# Altium project Fsociety_Keyboard.PrjPcb
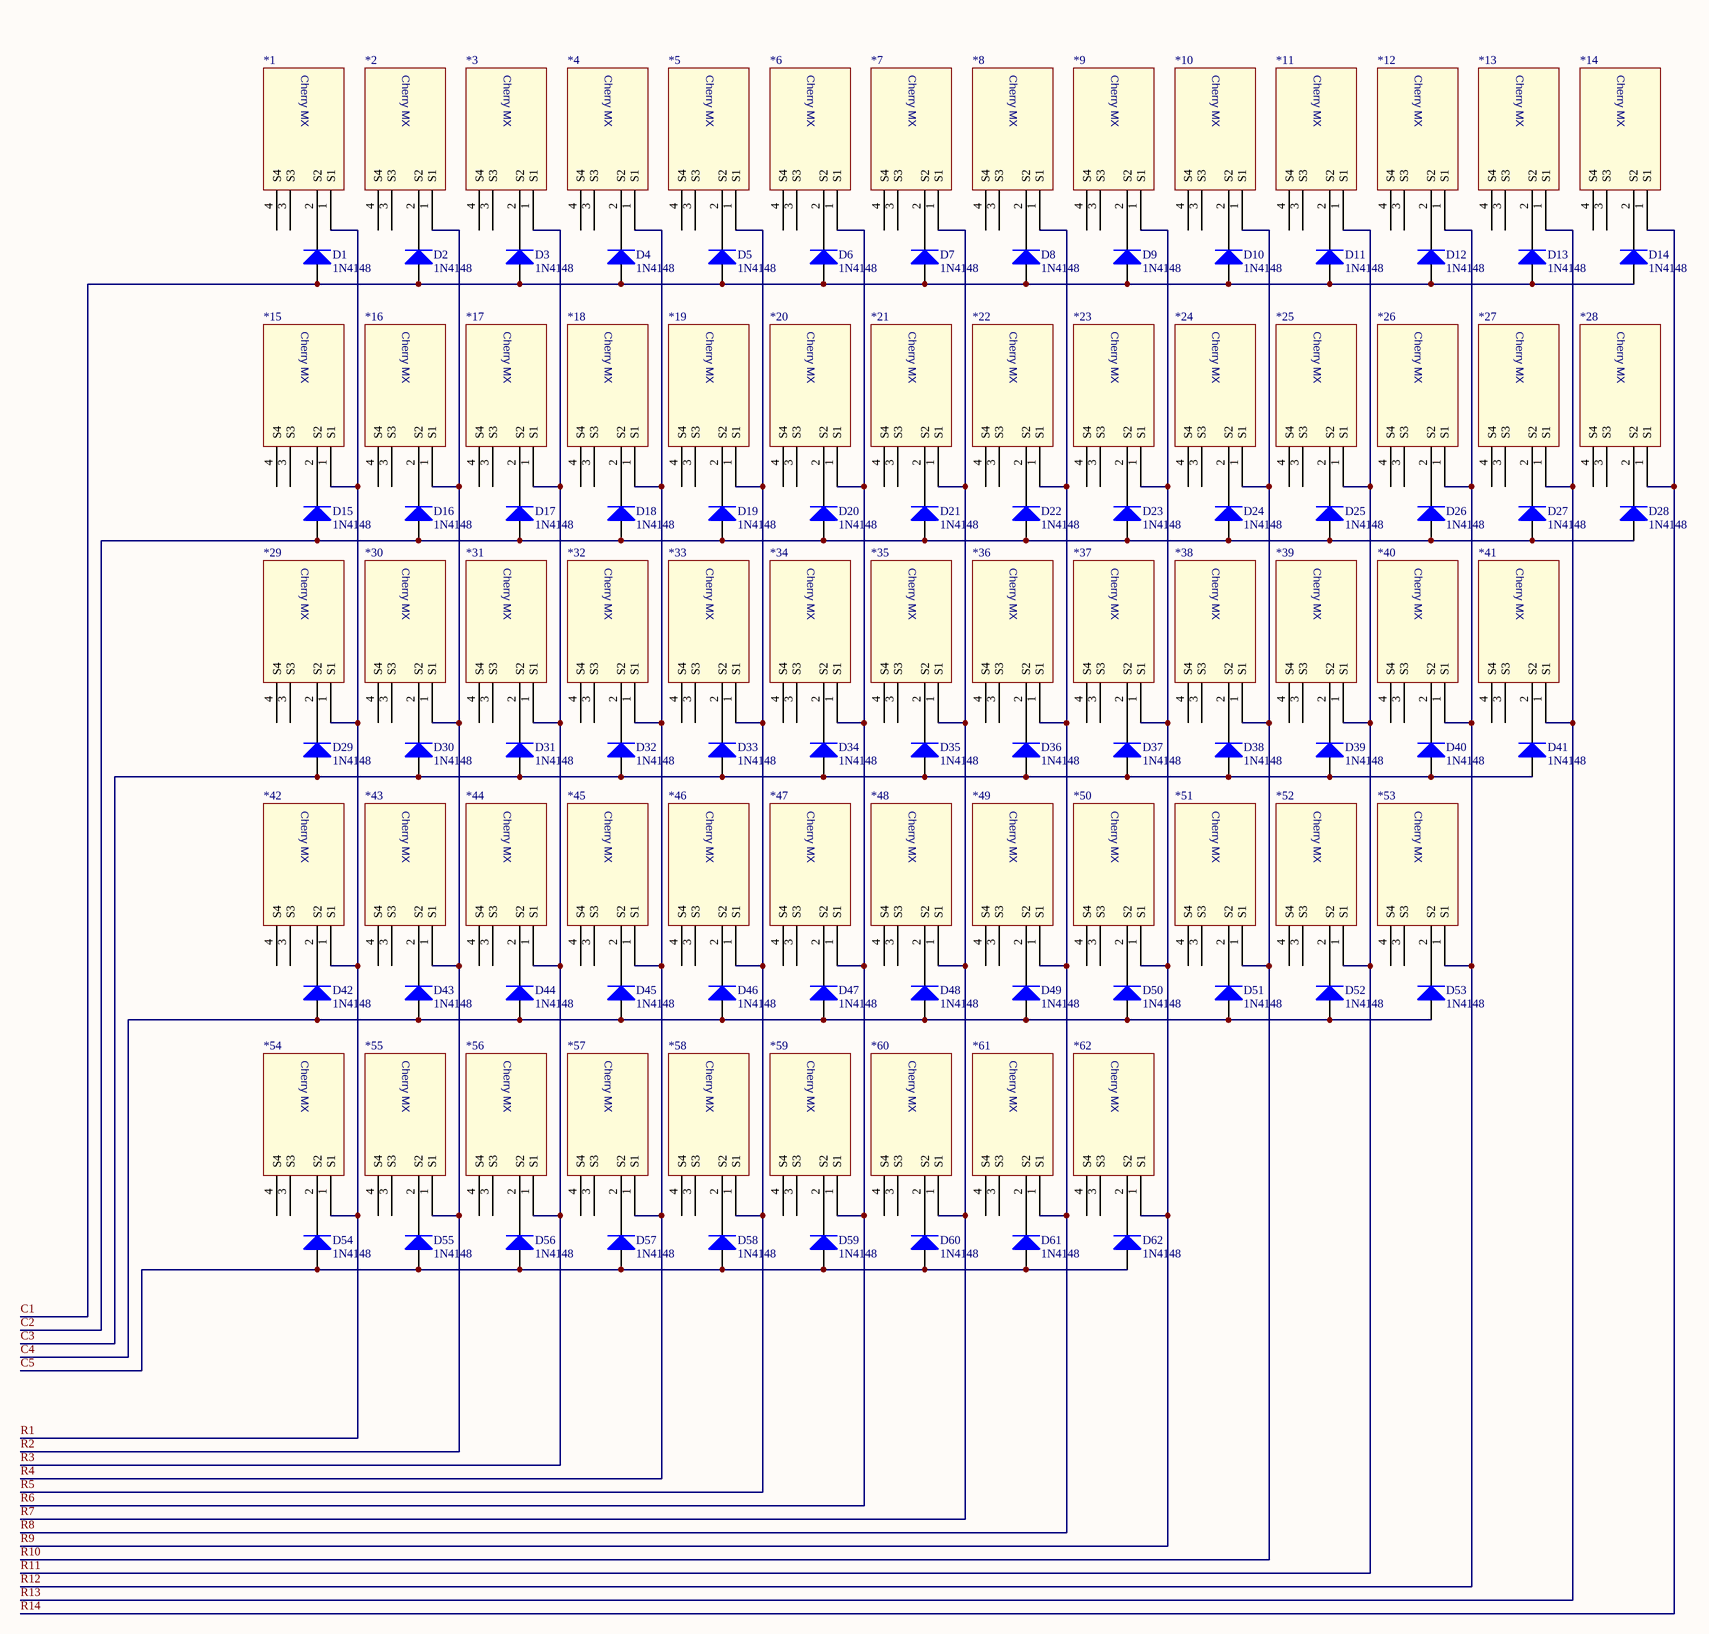
[diagram p0: Fsociety_Keyboard_SCH_Cherry.SchDoc]
3 sheets, 249 parts. Net scope: global (net labels, ports and power ports of the same name join across sheets).
Board file: Fsociety_Keyboard.PcbDoc
Sheets:
  Fsociety_Keyboard_SCH_Cherry.SchDoc
  Fsociety_Keyboard_SCH_LED.SchDoc
  Fsociety_Keyboard_SCH_Main.SchDoc

## Sheet Fsociety_Keyboard_SCH_Cherry.SchDoc: NEW DESIGN
size A2; CompanyName: Rena Electronica; Engineer: IK; Organization: Rena Electronica; Address1: de Ambachten 12; Address2: 4881 XZ; Address3: Zundert; Address4: the Netherlands; DocumentNumber: 05.xxx; Revision: 0.10; Customer: Klantnaam; PageSetup: Record=PageOptions|CenterHorizontal=True|CenterVertical=True|PrintScale=0.73|XCorrection=1.00|YCorrection=1.00|PrintKind=0|BorderSize=5000000|LeftOffset=0|BottomOffset=0|Orientation=2|PaperLength=1000|PaperWidth=1000|Scale=100|PaperSource=7|PrintQuality=-3|MediaType=1|DitherType=10|PrintScaleMode=1|PaperKind=A3|PaperIndex=8; ProjectName: R_NAAM.PRJ

### Parts
*1  CHERRY_MX  [CherryMX]  (value not drawn)
*2  CHERRY_MX  [CherryMX]  (value not drawn)
*3  CHERRY_MX  [CherryMX]  (value not drawn)
*4  CHERRY_MX  [CherryMX]  (value not drawn)
*5  CHERRY_MX  [CherryMX]  (value not drawn)
*6  CHERRY_MX  [CherryMX]  (value not drawn)
*7  CHERRY_MX  [CherryMX]  (value not drawn)
*8  CHERRY_MX  [CherryMX]  (value not drawn)
*9  CHERRY_MX  [CherryMX]  (value not drawn)
*10  CHERRY_MX  [CherryMX]  (value not drawn)
*11  CHERRY_MX  [CherryMX]  (value not drawn)
*12  CHERRY_MX  [CherryMX]  (value not drawn)
*13  CHERRY_MX  [CherryMX]  (value not drawn)
*14  CHERRY_MX  [CherryMX]  (value not drawn)
*15  CHERRY_MX  [CherryMX]  (value not drawn)
*16  CHERRY_MX  [CherryMX]  (value not drawn)
*17  CHERRY_MX  [CherryMX]  (value not drawn)
*18  CHERRY_MX  [CherryMX]  (value not drawn)
*19  CHERRY_MX  [CherryMX]  (value not drawn)
*20  CHERRY_MX  [CherryMX]  (value not drawn)
*21  CHERRY_MX  [CherryMX]  (value not drawn)
*22  CHERRY_MX  [CherryMX]  (value not drawn)
*23  CHERRY_MX  [CherryMX]  (value not drawn)
*24  CHERRY_MX  [CherryMX]  (value not drawn)
*25  CHERRY_MX  [CherryMX]  (value not drawn)
*26  CHERRY_MX  [CherryMX]  (value not drawn)
*27  CHERRY_MX  [CherryMX]  (value not drawn)
*28  CHERRY_MX  [CherryMX]  (value not drawn)
*29  CHERRY_MX  [CherryMX]  (value not drawn)
*30  CHERRY_MX  [CherryMX]  (value not drawn)
*31  CHERRY_MX  [CherryMX]  (value not drawn)
*32  CHERRY_MX  [CherryMX]  (value not drawn)
*33  CHERRY_MX  [CherryMX]  (value not drawn)
*34  CHERRY_MX  [CherryMX]  (value not drawn)
*35  CHERRY_MX  [CherryMX]  (value not drawn)
*36  CHERRY_MX  [CherryMX]  (value not drawn)
*37  CHERRY_MX  [CherryMX]  (value not drawn)
*38  CHERRY_MX  [CherryMX]  (value not drawn)
*39  CHERRY_MX  [CherryMX]  (value not drawn)
*40  CHERRY_MX  [CherryMX]  (value not drawn)
*41  CHERRY_MX  [CherryMX]  (value not drawn)
*42  CHERRY_MX  [CherryMX]  (value not drawn)
*43  CHERRY_MX  [CherryMX]  (value not drawn)
*44  CHERRY_MX  [CherryMX]  (value not drawn)
*45  CHERRY_MX  [CherryMX]  (value not drawn)
*46  CHERRY_MX  [CherryMX]  (value not drawn)
*47  CHERRY_MX  [CherryMX]  (value not drawn)
*48  CHERRY_MX  [CherryMX]  (value not drawn)
*49  CHERRY_MX  [CherryMX]  (value not drawn)
*50  CHERRY_MX  [CherryMX]  (value not drawn)
*51  CHERRY_MX  [CherryMX]  (value not drawn)
*52  CHERRY_MX  [CherryMX]  (value not drawn)
*53  CHERRY_MX  [CherryMX]  (value not drawn)
*54  CHERRY_MX  [CherryMX]  (value not drawn)
*55  CHERRY_MX  [CherryMX]  (value not drawn)
*56  CHERRY_MX  [CherryMX]  (value not drawn)
*57  CHERRY_MX  [CherryMX]  (value not drawn)
*58  CHERRY_MX  [CherryMX]  (value not drawn)
*59  CHERRY_MX  [CherryMX]  (value not drawn)
*60  CHERRY_MX  [CherryMX]  (value not drawn)
*61  CHERRY_MX  [CherryMX]  (value not drawn)
*62  CHERRY_MX  [CherryMX]  (value not drawn)
D1  1N4148  [DIOMELF3515_NR_SOD80C]
D2  1N4148  [DIOMELF3515_NR_SOD80C]
D3  1N4148  [DIOMELF3515_NR_SOD80C]
D4  1N4148  [DIOMELF3515_NR_SOD80C]
D5  1N4148  [DIOMELF3515_NR_SOD80C]
D6  1N4148  [DIOMELF3515_NR_SOD80C]
D7  1N4148  [DIOMELF3515_NR_SOD80C]
D8  1N4148  [DIOMELF3515_NR_SOD80C]
D9  1N4148  [DIOMELF3515_NR_SOD80C]
D10  1N4148  [DIOMELF3515_NR_SOD80C]
D11  1N4148  [DIOMELF3515_NR_SOD80C]
D12  1N4148  [DIOMELF3515_NR_SOD80C]
D13  1N4148  [DIOMELF3515_NR_SOD80C]
D14  1N4148  [DIOMELF3515_NR_SOD80C]
D15  1N4148  [DIOMELF3515_NR_SOD80C]
D16  1N4148  [DIOMELF3515_NR_SOD80C]
D17  1N4148  [DIOMELF3515_NR_SOD80C]
D18  1N4148  [DIOMELF3515_NR_SOD80C]
D19  1N4148  [DIOMELF3515_NR_SOD80C]
D20  1N4148  [DIOMELF3515_NR_SOD80C]
D21  1N4148  [DIOMELF3515_NR_SOD80C]
D22  1N4148  [DIOMELF3515_NR_SOD80C]
D23  1N4148  [DIOMELF3515_NR_SOD80C]
D24  1N4148  [DIOMELF3515_NR_SOD80C]
D25  1N4148  [DIOMELF3515_NR_SOD80C]
D26  1N4148  [DIOMELF3515_NR_SOD80C]
D27  1N4148  [DIOMELF3515_NR_SOD80C]
D28  1N4148  [DIOMELF3515_NR_SOD80C]
D29  1N4148  [DIOMELF3515_NR_SOD80C]
D30  1N4148  [DIOMELF3515_NR_SOD80C]
D31  1N4148  [DIOMELF3515_NR_SOD80C]
D32  1N4148  [DIOMELF3515_NR_SOD80C]
D33  1N4148  [DIOMELF3515_NR_SOD80C]
D34  1N4148  [DIOMELF3515_NR_SOD80C]
D35  1N4148  [DIOMELF3515_NR_SOD80C]
D36  1N4148  [DIOMELF3515_NR_SOD80C]
D37  1N4148  [DIOMELF3515_NR_SOD80C]
D38  1N4148  [DIOMELF3515_NR_SOD80C]
D39  1N4148  [DIOMELF3515_NR_SOD80C]
D40  1N4148  [DIOMELF3515_NR_SOD80C]
D41  1N4148  [DIOMELF3515_NR_SOD80C]
D42  1N4148  [DIOMELF3515_NR_SOD80C]
D43  1N4148  [DIOMELF3515_NR_SOD80C]
D44  1N4148  [DIOMELF3515_NR_SOD80C]
D45  1N4148  [DIOMELF3515_NR_SOD80C]
D46  1N4148  [DIOMELF3515_NR_SOD80C]
D47  1N4148  [DIOMELF3515_NR_SOD80C]
D48  1N4148  [DIOMELF3515_NR_SOD80C]
D49  1N4148  [DIOMELF3515_NR_SOD80C]
D50  1N4148  [DIOMELF3515_NR_SOD80C]
D51  1N4148  [DIOMELF3515_NR_SOD80C]
D52  1N4148  [DIOMELF3515_NR_SOD80C]
D53  1N4148  [DIOMELF3515_NR_SOD80C]
D54  1N4148  [DIOMELF3515_NR_SOD80C]
D55  1N4148  [DIOMELF3515_NR_SOD80C]
D56  1N4148  [DIOMELF3515_NR_SOD80C]
D57  1N4148  [DIOMELF3515_NR_SOD80C]
D58  1N4148  [DIOMELF3515_NR_SOD80C]
D59  1N4148  [DIOMELF3515_NR_SOD80C]
D60  1N4148  [DIOMELF3515_NR_SOD80C]
D61  1N4148  [DIOMELF3515_NR_SOD80C]
D62  1N4148  [DIOMELF3515_NR_SOD80C]

### Nets
C1: D1.A D2.A D3.A D4.A D5.A D6.A D7.A D8.A D9.A D10.A D11.A D12.A D13.A D14.A
C2: D15.A D16.A D17.A D18.A D19.A D20.A D21.A D22.A D23.A D24.A D25.A D26.A D27.A D28.A
C3: D29.A D30.A D31.A D32.A D33.A D34.A D35.A D36.A D37.A D38.A D39.A D40.A D41.A
C4: D42.A D43.A D44.A D45.A D46.A D47.A D48.A D49.A D50.A D51.A D52.A D53.A
C5: D54.A D55.A D56.A D57.A D58.A D59.A D60.A D61.A D62.A
R1: *1.1(S1) *15.1(S1) *29.1(S1) *42.1(S1) *54.1(S1)
R2: *2.1(S1) *16.1(S1) *30.1(S1) *43.1(S1) *55.1(S1)
R3: *3.1(S1) *17.1(S1) *31.1(S1) *44.1(S1) *56.1(S1)
R4: *4.1(S1) *18.1(S1) *32.1(S1) *45.1(S1) *57.1(S1)
R5: *5.1(S1) *19.1(S1) *33.1(S1) *46.1(S1) *58.1(S1)
R6: *6.1(S1) *20.1(S1) *34.1(S1) *47.1(S1) *59.1(S1)
R7: *7.1(S1) *21.1(S1) *35.1(S1) *48.1(S1) *60.1(S1)
R8: *8.1(S1) *22.1(S1) *36.1(S1) *49.1(S1) *61.1(S1)
R9: *9.1(S1) *23.1(S1) *37.1(S1) *50.1(S1) *62.1(S1)
R10: *10.1(S1) *24.1(S1) *38.1(S1) *51.1(S1)
R11: *11.1(S1) *25.1(S1) *39.1(S1) *52.1(S1)
R12: *12.1(S1) *26.1(S1) *40.1(S1) *53.1(S1)
R13: *13.1(S1) *27.1(S1) *41.1(S1)
R14: *14.1(S1) *28.1(S1)
Net*1_2: *1.2(S2) D1.C
Net*2_2: *2.2(S2) D2.C
Net*3_2: *3.2(S2) D3.C
Net*4_2: *4.2(S2) D4.C
Net*5_2: *5.2(S2) D5.C
Net*6_2: *6.2(S2) D6.C
Net*7_2: *7.2(S2) D7.C
Net*8_2: *8.2(S2) D8.C
Net*9_2: *9.2(S2) D9.C
Net*10_2: *10.2(S2) D10.C
Net*11_2: *11.2(S2) D11.C
Net*12_2: *12.2(S2) D12.C
Net*13_2: *13.2(S2) D13.C
Net*14_2: *14.2(S2) D14.C
Net*15_2: *15.2(S2) D15.C
Net*16_2: *16.2(S2) D16.C
Net*17_2: *17.2(S2) D17.C
Net*18_2: *18.2(S2) D18.C
Net*19_2: *19.2(S2) D19.C
Net*20_2: *20.2(S2) D20.C
Net*21_2: *21.2(S2) D21.C
Net*22_2: *22.2(S2) D22.C
Net*23_2: *23.2(S2) D23.C
Net*24_2: *24.2(S2) D24.C
Net*25_2: *25.2(S2) D25.C
Net*26_2: *26.2(S2) D26.C
Net*27_2: *27.2(S2) D27.C
Net*28_2: *28.2(S2) D28.C
Net*29_2: *29.2(S2) D29.C
Net*30_2: *30.2(S2) D30.C
Net*31_2: *31.2(S2) D31.C
Net*32_2: *32.2(S2) D32.C
Net*33_2: *33.2(S2) D33.C
Net*34_2: *34.2(S2) D34.C
Net*35_2: *35.2(S2) D35.C
Net*36_2: *36.2(S2) D36.C
Net*37_2: *37.2(S2) D37.C
Net*38_2: *38.2(S2) D38.C
Net*39_2: *39.2(S2) D39.C
Net*40_2: *40.2(S2) D40.C
Net*41_2: *41.2(S2) D41.C
Net*42_2: *42.2(S2) D42.C
Net*43_2: *43.2(S2) D43.C
Net*44_2: *44.2(S2) D44.C
Net*45_2: *45.2(S2) D45.C
Net*46_2: *46.2(S2) D46.C
Net*47_2: *47.2(S2) D47.C
Net*48_2: *48.2(S2) D48.C
Net*49_2: *49.2(S2) D49.C
Net*50_2: *50.2(S2) D50.C
Net*51_2: *51.2(S2) D51.C
Net*52_2: *52.2(S2) D52.C
Net*53_2: *53.2(S2) D53.C
Net*54_2: *54.2(S2) D54.C
Net*55_2: *55.2(S2) D55.C
Net*56_2: *56.2(S2) D56.C
Net*57_2: *57.2(S2) D57.C
Net*58_2: *58.2(S2) D58.C
Net*59_2: *59.2(S2) D59.C
Net*60_2: *60.2(S2) D60.C
Net*61_2: *61.2(S2) D61.C
Net*62_2: *62.2(S2) D62.C

Not connected (* = marked no-connect by the designer): *1 3(S3) 4(S4); *2 3(S3) 4(S4); *3 3(S3) 4(S4); *4 3(S3) 4(S4); *5 3(S3) 4(S4); *6 3(S3) 4(S4); *7 3(S3) 4(S4); *8 3(S3) 4(S4); *9 3(S3) 4(S4); *10 3(S3) 4(S4); *11 3(S3) 4(S4); *12 3(S3) 4(S4); *13 3(S3) 4(S4); *14 3(S3) 4(S4); *15 3(S3) 4(S4); *16 3(S3) 4(S4); *17 3(S3) 4(S4); *18 3(S3) 4(S4); *19 3(S3) 4(S4); *20 3(S3) 4(S4); *21 3(S3) 4(S4); *22 3(S3) 4(S4); *23 3(S3) 4(S4); *24 3(S3) 4(S4); *25 3(S3) 4(S4); *26 3(S3) 4(S4); *27 3(S3) 4(S4); *28 3(S3) 4(S4); *29 3(S3) 4(S4); *30 3(S3) 4(S4); *31 3(S3) 4(S4); *32 3(S3) 4(S4); *33 3(S3) 4(S4); *34 3(S3) 4(S4); *35 3(S3) 4(S4); *36 3(S3) 4(S4); *37 3(S3) 4(S4); *38 3(S3) 4(S4); *39 3(S3) 4(S4); *40 3(S3) 4(S4); *41 3(S3) 4(S4); *42 3(S3) 4(S4); *43 3(S3) 4(S4); *44 3(S3) 4(S4); *45 3(S3) 4(S4); *46 3(S3) 4(S4); *47 3(S3) 4(S4); *48 3(S3) 4(S4); *49 3(S3) 4(S4); *50 3(S3) 4(S4); *51 3(S3) 4(S4); *52 3(S3) 4(S4); *53 3(S3) 4(S4); *54 3(S3) 4(S4); *55 3(S3) 4(S4); *56 3(S3) 4(S4); *57 3(S3) 4(S4); *58 3(S3) 4(S4); *59 3(S3) 4(S4); *60 3(S3) 4(S4); *61 3(S3) 4(S4); *62 3(S3) 4(S4)

### Notes on the sheet
- (in symbol CHERRY_MX) Cherry MX

### Library data of the parts
D1-D62 = CMP-00137-A.4: Diode 1N4148 SOD80(SMT); MAXPartNumber: 1N4148!; PartNumber: LL4148-GS18-LF; Manufacturer: Vishay; IFSM Max (A): 0.5; Packing: Tape en Reel; Type: Fast; Reverse Voltage: 100V; Forward Voltage: ? V; IF (Cont): ? A; ComponentLink1Description: Manufacturer URL; ComponentLink1URL: http://www.vishay.com/; ComponentLink2Description: Datasheet; ComponentLink2URL: http://www.vishay.com/docs/85557/ll4148.pdf; ComponentLink3Description: Package Specification; ComponentLink3URL: http://www.vishay.com/docs/85557/ll4148.pdf; Mounting Technology: Surface Mount; PackageDescription: Melf Diode; PackageReference: SOD80; RoHS: TRUE; FLS_PN: 1N4148!; RENA_PN: 1N4148!; IF (Max): ? A

## Sheet Fsociety_Keyboard_SCH_LED.SchDoc: NEW DESIGN
size A1; CompanyName: Rena Electronica; Engineer: IK; Organization: Rena Electronica; Address1: de Ambachten 12; Address2: 4881 XZ; Address3: Zundert; Address4: the Netherlands; DocumentNumber: 05.xxx; Revision: 0.10; Customer: Klantnaam; PageSetup: Record=PageOptions|CenterHorizontal=True|CenterVertical=True|PrintScale=0.52|XCorrection=1.00|YCorrection=1.00|PrintKind=0|BorderSize=5000000|LeftOffset=0|BottomOffset=0|Orientation=2|PaperLength=1000|PaperWidth=1000|Scale=100|PaperSource=7|PrintQuality=-3|MediaType=1|DitherType=10|PrintScaleMode=1|PaperKind=A3|PaperIndex=8; ProjectName: R_NAAM.PRJ
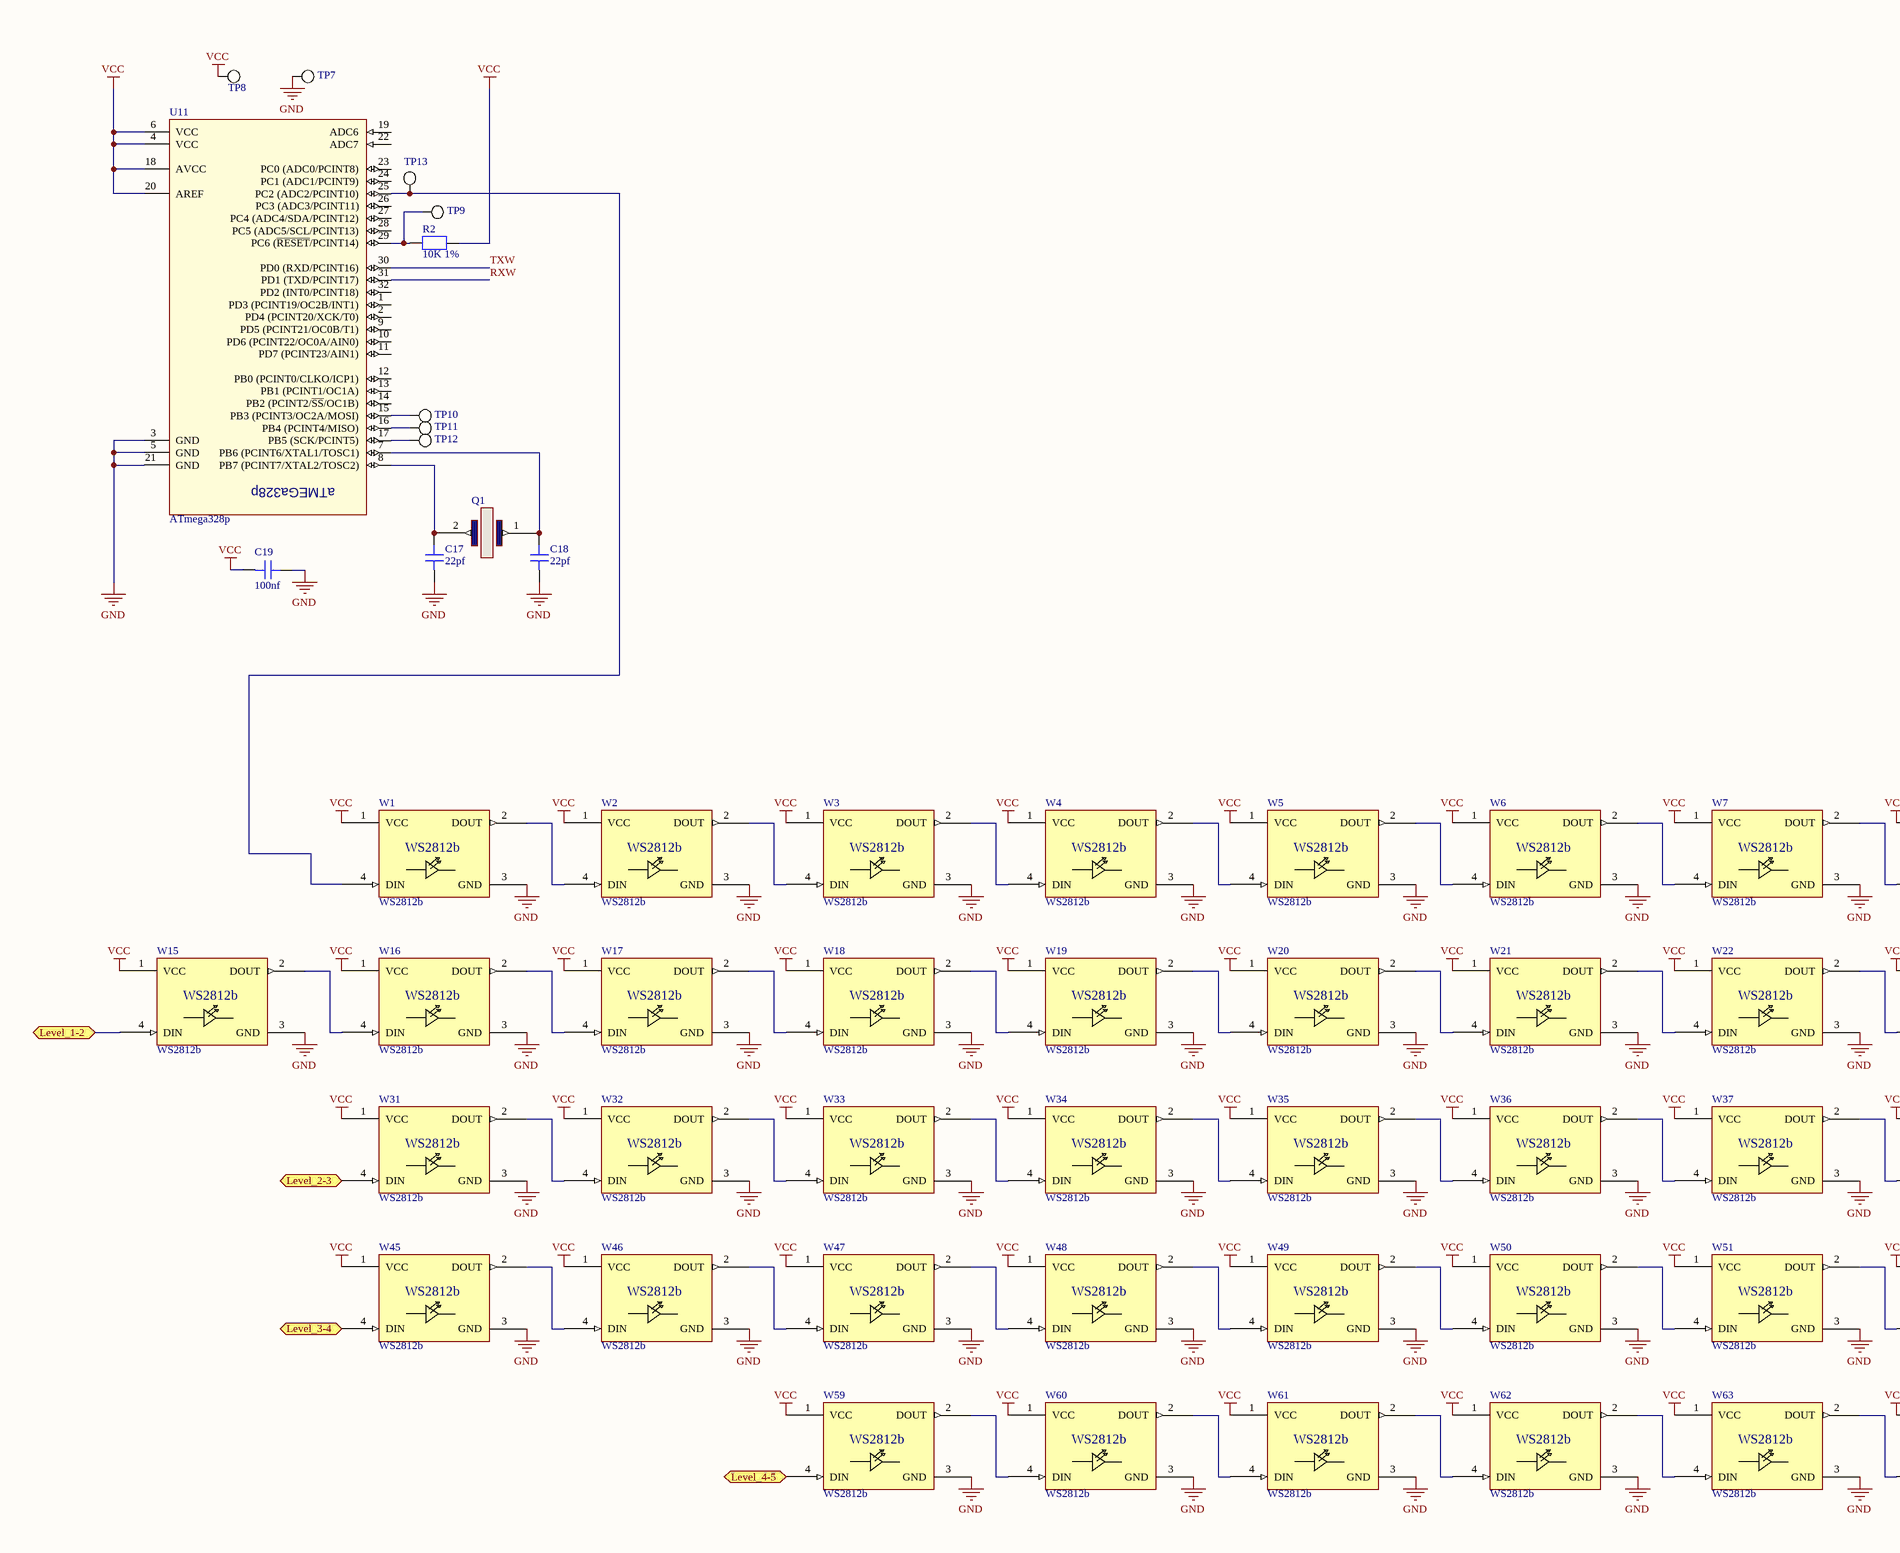
[diagram p1: Fsociety_Keyboard_SCH_LED.SchDoc, left]
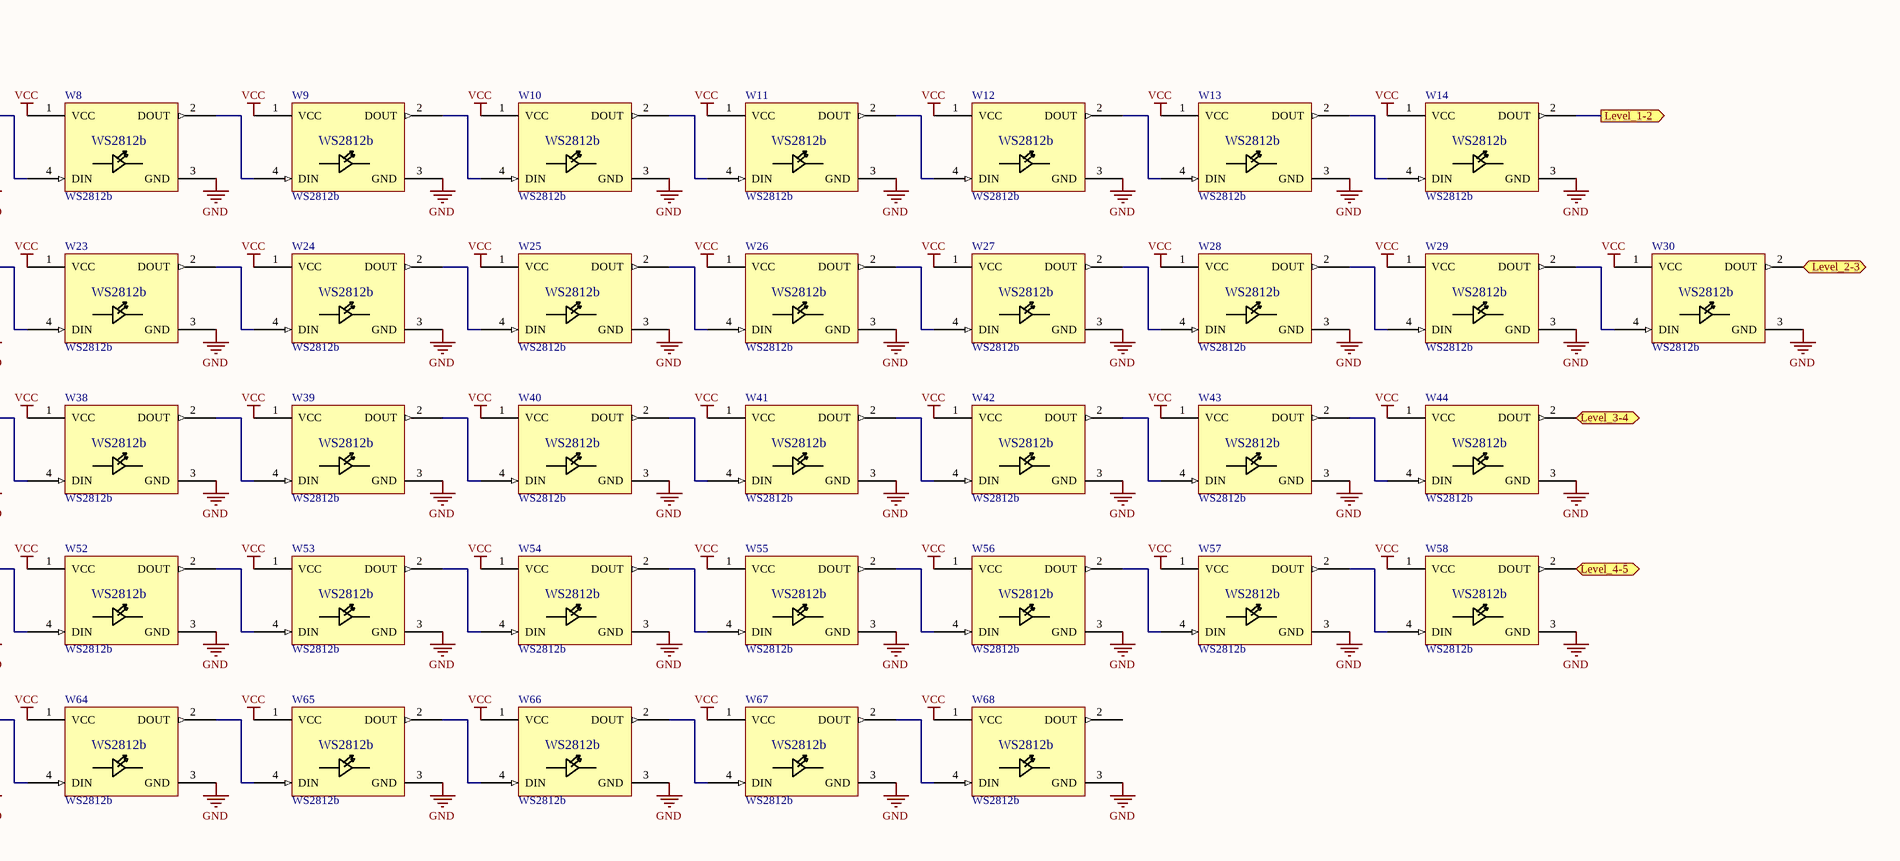
[diagram p2: Fsociety_Keyboard_SCH_LED.SchDoc, right]

### Parts
C17  22pf  [CAPC1608X08_NR]
C18  22pf  [CAPC1608X08_NR]
C19  100nf  [CAPC1608X08_NR]
Q1  Crystal_txc_sumasta  [Crystal_txc_sumasta]  (value not drawn)
R2  10K 1%  [RESC1608X06_NR]
TP7  TP  [TESTPAD-2MM]  (value not drawn)  (no BOM)
TP8  TP  [TESTPAD-2MM]  (value not drawn)  (no BOM)
TP9  TP  [TESTPAD-2MM]  (value not drawn)  (no BOM)
TP10  TP  [TESTPAD-2MM]  (value not drawn)  (no BOM)
TP11  TP  [TESTPAD-2MM]  (value not drawn)  (no BOM)
TP12  TP  [TESTPAD-2MM]  (value not drawn)  (no BOM)
TP13  TP  [TESTPAD-2MM]  (value not drawn)  (no BOM)
U11  ATmega328p  [TQFP32]
W1  WS2812b  [DIOC500500X250_NR]
W2  WS2812b  [DIOC500500X250_NR]
W3  WS2812b  [DIOC500500X250_NR]
W4  WS2812b  [DIOC500500X250_NR]
W5  WS2812b  [DIOC500500X250_NR]
W6  WS2812b  [DIOC500500X250_NR]
W7  WS2812b  [DIOC500500X250_NR]
W8  WS2812b  [DIOC500500X250_NR]
W9  WS2812b  [DIOC500500X250_NR]
W10  WS2812b  [DIOC500500X250_NR]
W11  WS2812b  [DIOC500500X250_NR]
W12  WS2812b  [DIOC500500X250_NR]
W13  WS2812b  [DIOC500500X250_NR]
W14  WS2812b  [DIOC500500X250_NR]
W15  WS2812b  [DIOC500500X250_NR]
W16  WS2812b  [DIOC500500X250_NR]
W17  WS2812b  [DIOC500500X250_NR]
W18  WS2812b  [DIOC500500X250_NR]
W19  WS2812b  [DIOC500500X250_NR]
W20  WS2812b  [DIOC500500X250_NR]
W21  WS2812b  [DIOC500500X250_NR]
W22  WS2812b  [DIOC500500X250_NR]
W23  WS2812b  [DIOC500500X250_NR]
W24  WS2812b  [DIOC500500X250_NR]
W25  WS2812b  [DIOC500500X250_NR]
W26  WS2812b  [DIOC500500X250_NR]
W27  WS2812b  [DIOC500500X250_NR]
W28  WS2812b  [DIOC500500X250_NR]
W29  WS2812b  [DIOC500500X250_NR]
W30  WS2812b  [DIOC500500X250_NR]
W31  WS2812b  [DIOC500500X250_NR]
W32  WS2812b  [DIOC500500X250_NR]
W33  WS2812b  [DIOC500500X250_NR]
W34  WS2812b  [DIOC500500X250_NR]
W35  WS2812b  [DIOC500500X250_NR]
W36  WS2812b  [DIOC500500X250_NR]
W37  WS2812b  [DIOC500500X250_NR]
W38  WS2812b  [DIOC500500X250_NR]
W39  WS2812b  [DIOC500500X250_NR]
W40  WS2812b  [DIOC500500X250_NR]
W41  WS2812b  [DIOC500500X250_NR]
W42  WS2812b  [DIOC500500X250_NR]
W43  WS2812b  [DIOC500500X250_NR]
W44  WS2812b  [DIOC500500X250_NR]
W45  WS2812b  [DIOC500500X250_NR]
W46  WS2812b  [DIOC500500X250_NR]
W47  WS2812b  [DIOC500500X250_NR]
W48  WS2812b  [DIOC500500X250_NR]
W49  WS2812b  [DIOC500500X250_NR]
W50  WS2812b  [DIOC500500X250_NR]
W51  WS2812b  [DIOC500500X250_NR]
W52  WS2812b  [DIOC500500X250_NR]
W53  WS2812b  [DIOC500500X250_NR]
W54  WS2812b  [DIOC500500X250_NR]
W55  WS2812b  [DIOC500500X250_NR]
W56  WS2812b  [DIOC500500X250_NR]
W57  WS2812b  [DIOC500500X250_NR]
W58  WS2812b  [DIOC500500X250_NR]
W59  WS2812b  [DIOC500500X250_NR]
W60  WS2812b  [DIOC500500X250_NR]
W61  WS2812b  [DIOC500500X250_NR]
W62  WS2812b  [DIOC500500X250_NR]
W63  WS2812b  [DIOC500500X250_NR]
W64  WS2812b  [DIOC500500X250_NR]
W65  WS2812b  [DIOC500500X250_NR]
W66  WS2812b  [DIOC500500X250_NR]
W67  WS2812b  [DIOC500500X250_NR]
W68  WS2812b  [DIOC500500X250_NR]

### Ports
Level_1-2, Level_1-2 (out), Level_2-3, Level_3-4, Level_4-5

### Nets
GND: C17.1 C18.1 C19.2 TP7.1 U11.3(GND) U11.5(GND) U11.21(GND) W1.3(GND) W2.3(GND) W3.3(GND) W4.3(GND) W5.3(GND) W6.3(GND) W7.3(GND) W8.3(GND) W9.3(GND) W10.3(GND) W11.3(GND) W12.3(GND) W13.3(GND) W14.3(GND) W15.3(GND) W16.3(GND) W17.3(GND) W18.3(GND) W19.3(GND) W20.3(GND) W21.3(GND) W22.3(GND) W23.3(GND) W24.3(GND) W25.3(GND) W26.3(GND) W27.3(GND) W28.3(GND) W29.3(GND) W30.3(GND) W31.3(GND) W32.3(GND) W33.3(GND) W34.3(GND) W35.3(GND) W36.3(GND) W37.3(GND) W38.3(GND) W39.3(GND) W40.3(GND) W41.3(GND) W42.3(GND) W43.3(GND) W44.3(GND) W45.3(GND) W46.3(GND) W47.3(GND) W48.3(GND) W49.3(GND) W50.3(GND) W51.3(GND) W52.3(GND) W53.3(GND) W54.3(GND) W55.3(GND) W56.3(GND) W57.3(GND) W58.3(GND) W59.3(GND) W60.3(GND) W61.3(GND) W62.3(GND) W63.3(GND) W64.3(GND) W65.3(GND) W66.3(GND) W67.3(GND) W68.3(GND)
VCC: C19.1 R2.1 TP8.1 U11.4(VCC) U11.6(VCC) U11.18(AVCC) U11.20(AREF) W1.1(VCC) W2.1(VCC) W3.1(VCC) W4.1(VCC) W5.1(VCC) W6.1(VCC) W7.1(VCC) W8.1(VCC) W9.1(VCC) W10.1(VCC) W11.1(VCC) W12.1(VCC) W13.1(VCC) W14.1(VCC) W15.1(VCC) W16.1(VCC) W17.1(VCC) W18.1(VCC) W19.1(VCC) W20.1(VCC) W21.1(VCC) W22.1(VCC) W23.1(VCC) W24.1(VCC) W25.1(VCC) W26.1(VCC) W27.1(VCC) W28.1(VCC) W29.1(VCC) W30.1(VCC) W31.1(VCC) W32.1(VCC) W33.1(VCC) W34.1(VCC) W35.1(VCC) W36.1(VCC) W37.1(VCC) W38.1(VCC) W39.1(VCC) W40.1(VCC) W41.1(VCC) W42.1(VCC) W43.1(VCC) W44.1(VCC) W45.1(VCC) W46.1(VCC) W47.1(VCC) W48.1(VCC) W49.1(VCC) W50.1(VCC) W51.1(VCC) W52.1(VCC) W53.1(VCC) W54.1(VCC) W55.1(VCC) W56.1(VCC) W57.1(VCC) W58.1(VCC) W59.1(VCC) W60.1(VCC) W61.1(VCC) W62.1(VCC) W63.1(VCC) W64.1(VCC) W65.1(VCC) W66.1(VCC) W67.1(VCC) W68.1(VCC)
RXW: U11.31(PD1_(TXD/PCINT17))
TXW: U11.30(PD0_(RXD/PCINT16))
NetC17_2: C17.2 Q1.2 U11.8(PB7_(PCINT7/XTAL2/TOSC2))
NetC18_2: C18.2 Q1.1 U11.7(PB6_(PCINT6/XTAL1/TOSC1))
NetR2_2: R2.2 TP9.1 U11.29(PC6_(~{RESET}/PCINT14))
NetTP10_1: TP10.1 U11.15(PB3_(PCINT3/OC2A/MOSI))
NetTP11_1: TP11.1 U11.16(PB4_(PCINT4/MISO))
NetTP12_1: TP12.1 U11.17(PB5_(SCK/PCINT5))
NetTP13_1: TP13.1 U11.25(PC2_(ADC2/PCINT10)) W1.4(DIN)
NetW1_2: W1.2(DOUT) W2.4(DIN)
NetW2_2: W2.2(DOUT) W3.4(DIN)
NetW3_2: W3.2(DOUT) W4.4(DIN)
NetW4_2: W4.2(DOUT) W5.4(DIN)
NetW5_2: W5.2(DOUT) W6.4(DIN)
NetW6_2: W6.2(DOUT) W7.4(DIN)
NetW7_2: W7.2(DOUT) W8.4(DIN)
NetW8_2: W8.2(DOUT) W9.4(DIN)
NetW9_2: W9.2(DOUT) W10.4(DIN)
NetW10_2: W10.2(DOUT) W11.4(DIN)
NetW11_2: W11.2(DOUT) W12.4(DIN)
NetW12_2: W12.2(DOUT) W13.4(DIN)
NetW13_2: W13.2(DOUT) W14.4(DIN)
NetW14_2: W14.2(DOUT) W15.4(DIN) ; port Level_1-2
NetW15_2: W15.2(DOUT) W16.4(DIN)
NetW16_2: W16.2(DOUT) W17.4(DIN)
NetW17_2: W17.2(DOUT) W18.4(DIN)
NetW18_2: W18.2(DOUT) W19.4(DIN)
NetW19_2: W19.2(DOUT) W20.4(DIN)
NetW20_2: W20.2(DOUT) W21.4(DIN)
NetW21_2: W21.2(DOUT) W22.4(DIN)
NetW22_2: W22.2(DOUT) W23.4(DIN)
NetW23_2: W23.2(DOUT) W24.4(DIN)
NetW24_2: W24.2(DOUT) W25.4(DIN)
NetW25_2: W25.2(DOUT) W26.4(DIN)
NetW26_2: W26.2(DOUT) W27.4(DIN)
NetW27_2: W27.2(DOUT) W28.4(DIN)
NetW28_2: W28.2(DOUT) W29.4(DIN)
NetW29_2: W29.2(DOUT) W30.4(DIN)
NetW30_2: W30.2(DOUT) W31.4(DIN) ; port Level_2-3
NetW31_2: W31.2(DOUT) W32.4(DIN)
NetW32_2: W32.2(DOUT) W33.4(DIN)
NetW33_2: W33.2(DOUT) W34.4(DIN)
NetW34_2: W34.2(DOUT) W35.4(DIN)
NetW35_2: W35.2(DOUT) W36.4(DIN)
NetW36_2: W36.2(DOUT) W37.4(DIN)
NetW37_2: W37.2(DOUT) W38.4(DIN)
NetW38_2: W38.2(DOUT) W39.4(DIN)
NetW39_2: W39.2(DOUT) W40.4(DIN)
NetW40_2: W40.2(DOUT) W41.4(DIN)
NetW41_2: W41.2(DOUT) W42.4(DIN)
NetW42_2: W42.2(DOUT) W43.4(DIN)
NetW43_2: W43.2(DOUT) W44.4(DIN)
NetW44_2: W44.2(DOUT) W45.4(DIN) ; port Level_3-4
NetW45_2: W45.2(DOUT) W46.4(DIN)
NetW46_2: W46.2(DOUT) W47.4(DIN)
NetW47_2: W47.2(DOUT) W48.4(DIN)
NetW48_2: W48.2(DOUT) W49.4(DIN)
NetW49_2: W49.2(DOUT) W50.4(DIN)
NetW50_2: W50.2(DOUT) W51.4(DIN)
NetW51_2: W51.2(DOUT) W52.4(DIN)
NetW52_2: W52.2(DOUT) W53.4(DIN)
NetW53_2: W53.2(DOUT) W54.4(DIN)
NetW54_2: W54.2(DOUT) W55.4(DIN)
NetW55_2: W55.2(DOUT) W56.4(DIN)
NetW56_2: W56.2(DOUT) W57.4(DIN)
NetW57_2: W57.2(DOUT) W58.4(DIN)
NetW58_2: W58.2(DOUT) W59.4(DIN) ; port Level_4-5
NetW59_2: W59.2(DOUT) W60.4(DIN)
NetW60_2: W60.2(DOUT) W61.4(DIN)
NetW61_2: W61.2(DOUT) W62.4(DIN)
NetW62_2: W62.2(DOUT) W63.4(DIN)
NetW63_2: W63.2(DOUT) W64.4(DIN)
NetW64_2: W64.2(DOUT) W65.4(DIN)
NetW65_2: W65.2(DOUT) W66.4(DIN)
NetW66_2: W66.2(DOUT) W67.4(DIN)
NetW67_2: W67.2(DOUT) W68.4(DIN)

Not connected (* = marked no-connect by the designer): U11 1(PD3_(PCINT19/OC2B/INT1)) 2(PD4_(PCINT20/XCK/T0)) 9(PD5_(PCINT21/OC0B/T1)) 10(PD6_(PCINT22/OC0A/AIN0)) 11(PD7_(PCINT23/AIN1)) 12(PB0_(PCINT0/CLKO/ICP1)) 13(PB1_(PCINT1/OC1A)) 14(PB2_(PCINT2/~{SS}/OC1B)) 19(ADC6) 22(ADC7) 23(PC0_(ADC0/PCINT8)) 24(PC1_(ADC1/PCINT9)) 26(PC3_(ADC3/PCINT11)) 27(PC4_(ADC4/SDA/PCINT12)) 28(PC5_(ADC5/SCL/PCINT13)) 32(PD2_(INT0/PCINT18)); W68 2(DOUT)

### Notes on the sheet
- (in symbol ATmega328p) aTMEGa328p

### Library data of the parts
C17-C19 = CMP-00064-A.5: Capacitor 10nF X7R ±10% 50V 0603(1608) SMD; MAXPartNumber: 10N/50-0603!; Case-EIA: 0603; Case-Metric: 1608; Value: 10nF; Dielectric Characteristic: X7R; Thickness (max): 0.9mm; Tolerance: ±10%; Voltage: 50V
R2 = CMP-00060-A.4: 10K  0.1W 1% 0603(1608 Metric) SMD; MaxPartNumber: 10K-0603!; Case-EIA: 0603; Case-Metric: 1608; Value: 10K Ohm; Power: 0.1W; Technology: SMT; Tolerance: 1%; FLS_PN: 10K-0603!; RENA_PN: 10K-0603!
TP7-TP13 = CMP-00759-A.11: TESTPOINT; FLS_PN: TP#; RENA_PN: TP#; MAXPartNumber: TP#; ComponentLink1Description: Manufacturer URL; ComponentLink2Description: Datasheet; ComponentLink3Description: Package Specification
W1-W68 = WS2812b_Sumasta: The Infamous Chinese Chainable RGB LED

## Sheet Fsociety_Keyboard_SCH_Main.SchDoc: NEW DESIGN
size A2; CompanyName: Rena Electronica; Engineer: IK; Organization: Rena Electronica; Address1: de Ambachten 12; Address2: 4881 XZ; Address3: Zundert; Address4: the Netherlands; DocumentNumber: 05.xxx; Revision: 0.10; Customer: Klantnaam; PageSetup: Record=PageOptions|CenterHorizontal=True|CenterVertical=True|PrintScale=0.73|XCorrection=1.00|YCorrection=1.00|PrintKind=0|BorderSize=5000000|LeftOffset=0|BottomOffset=0|Orientation=2|PaperLength=1000|PaperWidth=1000|Scale=100|PaperSource=7|PrintQuality=-3|MediaType=1|DitherType=10|PrintScaleMode=1|PaperKind=A3|PaperIndex=8; ProjectName: R_NAAM.PRJ
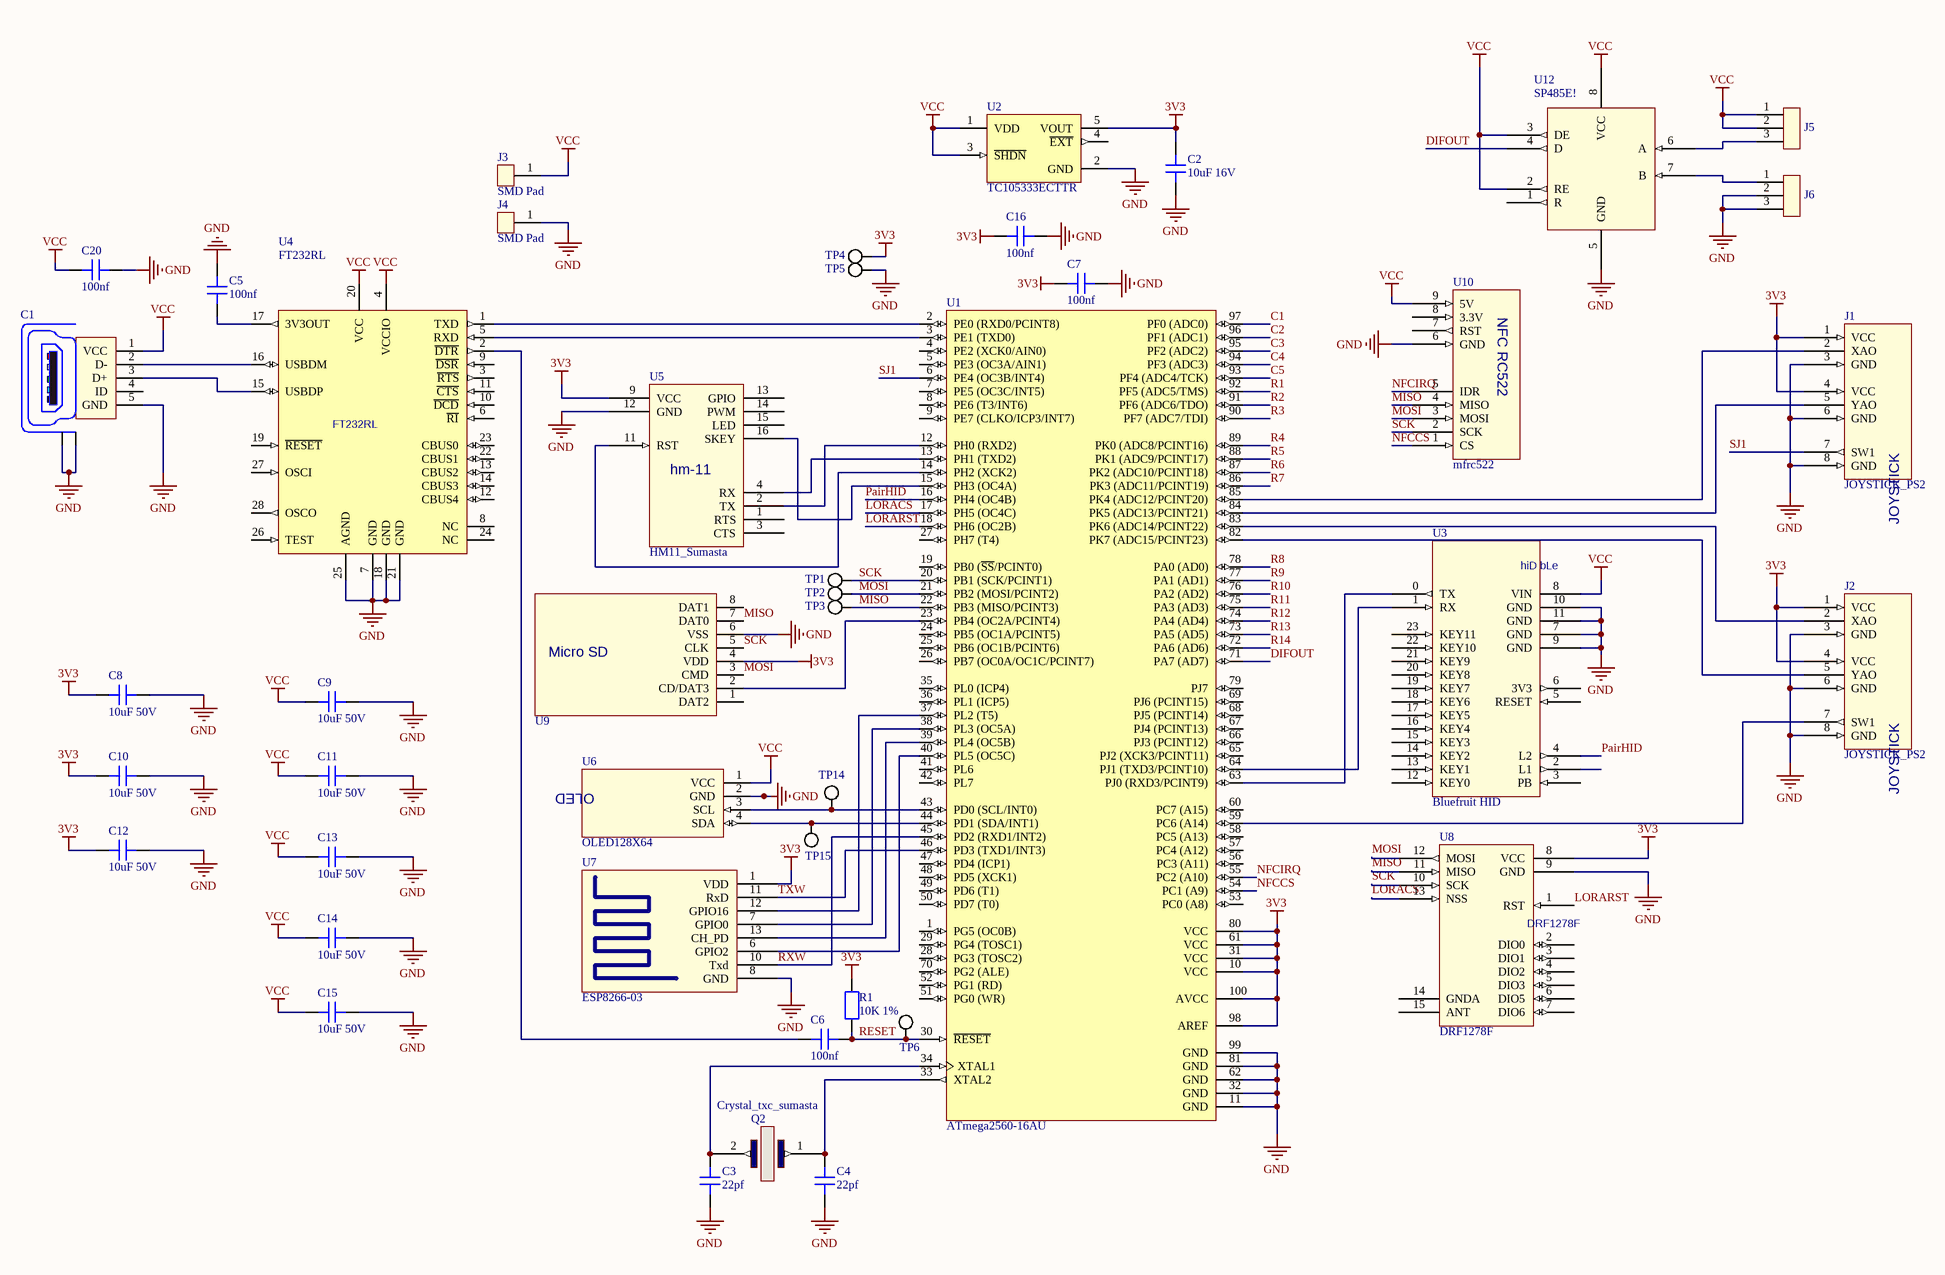
[diagram p3: Fsociety_Keyboard_SCH_Main.SchDoc]

### Parts
C1  WR-Communication Connectors 629105150921  [629105150921]  (value not drawn)
C2  10uF 16V  [CAPC1608X08_NR]
C3  22pf  [CAPC1608X08_NR]
C4  22pf  [CAPC1608X08_NR]
C5  100nf  [CAPC1608X08_NR]
C6  100nf  [CAPC1608X08_NR]
C7  100nf  [CAPC1608X08_NR]
C8  10uF 50V  [CAPC3216X09_MW]
C9  10uF 50V  [CAPC3216X09_MW]
C10  10uF 50V  [CAPC3216X09_MW]
C11  10uF 50V  [CAPC3216X09_MW]
C12  10uF 50V  [CAPC3216X09_MW]
C13  10uF 50V  [CAPC3216X09_MW]
C14  10uF 50V  [CAPC3216X09_MW]
C15  10uF 50V  [CAPC3216X09_MW]
C16  100nf  [CAPC1608X08_NR]
C20  100nf  [CAPC1608X08_NR]
J1  JOYSTICK_PS2  [JOYSTICK]
J2  JOYSTICK_PS2  [JOYSTICK]
J3  SMD Pad  [CON_SMDPAD_10X5]  (no BOM)
J4  SMD Pad  [CON_SMDPAD_10X5]  (no BOM)
J5  BB02-HA031-KB1-100/33/D1  [FCI_77315-134-03LF]  (value not drawn)
J6  BB02-HA031-KB1-100/33/D1  [FCI_77315-134-03LF]  (value not drawn)
Q2  Crystal_txc_sumasta  [Crystal_txc_sumasta]
R1  10K 1%  [RESC1608X06_NR]
TP1  TP  [TESTPAD-2MM]  (value not drawn)  (no BOM)
TP2  TP  [TESTPAD-2MM]  (value not drawn)  (no BOM)
TP3  TP  [TESTPAD-2MM]  (value not drawn)  (no BOM)
TP4  TP  [TESTPAD-2MM]  (value not drawn)  (no BOM)
TP5  TP  [TESTPAD-2MM]  (value not drawn)  (no BOM)
TP6  TP  [TESTPAD-2MM]  (value not drawn)  (no BOM)
TP14  TP  [TESTPAD-2MM]  (value not drawn)  (no BOM)
TP15  TP  [TESTPAD-2MM]  (value not drawn)  (no BOM)
U1  ATmega2560-16AU  [100A_N]
U2  TC105333ECTTR  [SOT-23-CT5_N]
U3  Bluefruit HID  [BLuefruit HID]
U4  FT232RL  [SSPO28]
U5  HM11_Sumasta  [HM11_Sumasta]
U6  OLED128X64  [OLED128x64]
U7  ESP8266-03  [ESP8266-03]
U8  DRF1278F  [DRF1278F]
U9  Micro SD Connector - Hinge  [Micro SD Socket]  (value not drawn)
U10  mfrc522  [MFRC522]
U12  MAXPartNumber: SP485E!  [SOIC127P600-8N]  (hidden comment: RS485 Buffer Transceiver)

### Nets
3V3: C2.2 C7.1 C8.1 C10.1 C12.1 C16.1 J1.1(VCC) J1.4(VCC) J2.1(VCC) J2.4(VCC) R1.2 TP4.1 U1.10(VCC) U1.31(VCC) U1.61(VCC) U1.80(VCC) U1.98(AREF) U1.100(AVCC) U2.5(VOUT) U5.9(VCC) U7.1(VDD) U8.8(VCC) U9.4(VDD)
GND: C1.5(GND) C1.Z1(Shield) C1.Z2(Shield) C2.1 C3.1 C4.1 C5.2 C7.2 C8.2 C9.2 C10.2 C11.2 C12.2 C13.2 C14.2 C15.2 C16.2 C20.1 J1.3(GND) J1.6(GND) J1.8(GND) J2.3(GND) J2.6(GND) J2.8(GND) J4.1 J6.2 J6.3 TP5.1 U1.11(GND) U1.32(GND) U1.62(GND) U1.81(GND) U1.99(GND) U2.2(GND) U3.7(GND) U3.9(GND) U3.10(GND) U3.11(GND) U4.7(GND) U4.18(GND) U4.21(GND) U4.25(AGND) U5.12(GND) U6.2(GND) U7.8(GND) U8.9(GND) U9.6(VSS) U10.6(GND) U12.5(GND)
VCC: C1.1(VCC) C9.1 C11.1 C13.1 C14.1 C15.1 C20.2 J3.1 J5.1 J5.2 U2.1(VDD) U2.3(~{SHDN}) U3.8(VIN) U4.4(VCCIO) U4.20(VCC) U6.1(VCC) U10.9(5V) U12.2(RE) U12.3(DE) U12.8(VCC)
C1: U1.97(PF0_(ADC0))
C2: U1.96(PF1_(ADC1))
C3: U1.95(PF2_(ADC2))
C4: U1.94(PF3_(ADC3))
C5: U1.93(PF4_(ADC4/TCK))
DIFOUT: U1.71(PA7_(AD7)) U12.4(D)
LORACS: U1.17(PH5_(OC4C)) U8.13(NSS)
LORARST: U1.18(PH6_(OC2B)) U8.1(RST)
MISO: TP3.1 U1.22(PB3_(MISO/PCINT3)) U8.11(MISO) U9.7(DAT0) U10.4(MISO)
MOSI: TP2.1 U1.21(PB2_(MOSI/PCINT2)) U8.12(MOSI) U9.3(CMD) U10.3(MOSI)
NFCCS: U1.54(PC1_(A9)) U10.1(CS)
NFCIRQ: U1.55(PC2_(A10)) U10.5(IDR)
PairHID: U1.16(PH4_(OC4B)) U3.4(L2)
R1: U1.92(PF5_(ADC5/TMS))
R2: U1.91(PF6_(ADC6/TDO))
R3: U1.90(PF7_(ADC7/TDI))
R4: U1.89(PK0_(ADC8/PCINT16))
R5: U1.88(PK1_(ADC9/PCINT17))
R6: U1.87(PK2_(ADC10/PCINT18))
R7: U1.86(PK3_(ADC11/PCINT19))
R8: U1.78(PA0_(AD0))
R9: U1.77(PA1_(AD1))
R10: U1.76(PA2_(AD2))
R11: U1.75(PA3_(AD3))
R12: U1.74(PA4_(AD4))
R13: U1.73(PA5_(AD5))
R14: U1.72(PA6_(AD6))
RESET: C6.2 R1.1 TP6.1 U1.30(~{RESET})
RXW: U1.45(PD2_(RXD1/INT2)) U7.10(Txd)
SCK: TP1.1 U1.20(PB1_(SCK/PCINT1)) U8.10(SCK) U9.5(CLK) U10.2(SCK)
SJ1: J1.7(SW1) U1.6(PE4_(OC3B/INT4))
TXW: U1.46(PD3_(TXD1/INT3)) U7.11(RxD)
NetC1_2: C1.2(D-) U4.16(USBDM)
NetC1_3: C1.3(D+) U4.15(USBDP)
NetC3_2: C3.2 Q2.2 U1.34(XTAL1)
NetC4_2: C4.2 Q2.1 U1.33(XTAL2)
NetC5_1: C5.1 U4.17(3V3OUT)
NetC6_1: C6.1 U4.2(~{DTR})
NetJ1_2: J1.2(XAO) U1.85(PK4_(ADC12/PCINT20))
NetJ1_5: J1.5(YAO) U1.84(PK5_(ADC13/PCINT21))
NetJ2_2: J2.2(XAO) U1.83(PK6_(ADC14/PCINT22))
NetJ2_5: J2.5(YAO) U1.82(PK7_(ADC15/PCINT23))
NetJ2_7: J2.7(SW1) U1.59(PC6_(A14))
NetJ5_3: J5.3 U12.6(A)
NetJ6_1: J6.1 U12.7(B)
NetTP14_1: TP14.1 U1.43(PD0_(SCL/INT0)) U6.3(SCL)
NetTP15_1: TP15.1 U1.44(PD1_(SDA/INT1)) U6.4(SDA)
NetU1_2: U1.2(PE0_(RXD0/PCINT8)) U4.1(TXD)
NetU1_3: U1.3(PE1_(TXD0)) U4.5(RXD)
NetU1_12: U1.12(PH0_(RXD2)) U5.2(TX)
NetU1_13: U1.13(PH1_(TXD2)) U5.4(RX)
NetU1_14: U1.14(PH2_(XCK2)) U5.11(RST)
NetU1_15: U1.15(PH3_(OC4A)) U5.16(SKEY)
NetU1_23: U1.23(PB4_(OC2A/PCINT4)) U9.2(CD/DAT3)
NetU1_37: U1.37(PL2_(T5)) U7.12(GPIO16)
NetU1_38: U1.38(PL3_(OC5A)) U7.7(GPIO0)
NetU1_39: U1.39(PL4_(OC5B)) U7.13(CH_PD)
NetU1_40: U1.40(PL5_(OC5C)) U7.6(GPIO2)
NetU1_63: U1.63(PJ0_(RXD3/PCINT9)) U3.0(TX)
NetU1_64: U1.64(PJ1_(TXD3/PCINT10)) U3.1(RX)

Not connected (* = marked no-connect by the designer): C1 4(ID); U1 1(PG5_(OC0B)) 4(PE2_(XCK0/AIN0)) 5(PE3_(OC3A/AIN1)) 7(PE5_(OC3C/INT5)) 8(PE6_(T3/INT6)) 9(PE7_(CLKO/ICP3/INT7)) 19(PB0_(~{SS}/PCINT0)) 24(PB5_(OC1A/PCINT5)) 25(PB6_(OC1B/PCINT6)) 26(PB7_(OC0A/OC1C/PCINT7)) 27(PH7_(T4)) 28(PG3_(TOSC2)) 29(PG4_(TOSC1)) 35(PL0_(ICP4)) 36(PL1_(ICP5)) 41(PL6) 42(PL7) 47(PD4_(ICP1)) 48(PD5_(XCK1)) 49(PD6_(T1)) 50(PD7_(T0)) 51(PG0_(WR)) 52(PG1_(RD)) 53(PC0_(A8)) 56(PC3_(A11)) 57(PC4_(A12)) 58(PC5_(A13)) 60(PC7_(A15)) 65(PJ2_(XCK3/PCINT11)) 66(PJ3_(PCINT12)) 67(PJ4_(PCINT13)) 68(PJ5_(PCINT14)) 69(PJ6_(PCINT15)) 70(PG2_(ALE)) 79(PJ7); U2 4(~{EXT}); U3 2(L1) 3(PB) 5(RESET) 6(3V3) 12(KEY0) 13(KEY1) 14(KEY2) 15(KEY3) 16(KEY4) 17(KEY5) 18(KEY6) 19(KEY7) 20(KEY8) 21(KEY9) 22(KEY10) 23(KEY11); U4 3(~{RTS}) 6(~{RI}) 8(NC) 9(~{DSR}) 10(~{DCD}) 11(~{CTS}) 12(CBUS4) 13(CBUS2) 14(CBUS3) 19(~{RESET}) 22(CBUS1) 23(CBUS0) 24(NC) 26(TEST) 27(OSCI) 28(OSCO); U5 1(RTS) 3(CTS) 13(GPIO) 14(PWM) 15(LED); U8 2(DIO0) 3(DIO1) 4(DIO2) 5(DIO3) 6(DIO5) 7(DIO6) 14(GNDA) 15(ANT); U9 1(DAT2) 8(DAT1); U10 7(RST) 8(3.3V); U12 1(R)

### Notes on the sheet
- (in symbol Bluefruit HID) hiD bLe
- (in symbol HM11_Sumasta) hm-11
- (in symbol JOYSTICK_PS2) JOYSTICK
- (in symbol mfrc522) NFC RC522
- (in symbol MicroSD Socket) Micro SD
- (in symbol OLED128X64) OLED

### Library data of the parts
C1 = WR-Communication Connectors 629105150921: WR-COM_USB_Micro Type AB_Horizontal_SMT; Manufacturer: Würth Elektronik eiSos GmbH; ComponentLink1 Description: Manufacturer; ComponentLink2 Description: Datasheet; NoPins: 5; ComponentLink1URL: http://www.we-online.de; ComponentLink2URL: http://katalog.we-online.de/em/datasheet/629105150921.pdf; Created by: Karrer Zheng; Created Date: 10/23/2014; partNo: 629105150921
C2-C7 C16 C20 = CMP-00064-A.5: as C17 on sheet Fsociety_Keyboard_SCH_LED; Value: 10nF; Dielectric Characteristic: X7R; Thickness (max): 0.9mm; Tolerance: ±10%; Voltage: 50V
C8-C15 = CMP-01312-A.1: Capacitor 10uF X5R ±20% 50V 1206(3216) SMD; MAXPartNumber: 10U/50!; Case-Metric: 3216; Case-EIA: 1206; Value: 10uF; Thickness (max): 1.8mm; Voltage: 50V; Tolerance: ±20%; Dielectric Characteristic: X5R
J3 J4 = CMP-00667-A.10: SMD PAD DIFFERENT SHAPES; MAXPartNumber: PAD_SMD!#; FLS_PN: PAD_SMD!#; RENA_PN: PAD_SMD!#
J5 J6 = CMP-01396-A.1: Unshrouded header 3-pin right angle; FLS_PN: CON-BB02-HA031; RENA_PN: CON-BB02-HA031; MAXPartNumber: CON-BB02-HA031
R1 = CMP-00060-A.4: as R2 on sheet Fsociety_Keyboard_SCH_LED; Power: 0.1W; Technology: SMT; Tolerance: 1%; FLS_PN: 10K-0603!; RENA_PN: 10K-0603!
TP1-TP6 TP14 TP15 = CMP-00759-A.11: TESTPOINT; FLS_PN: TP#; RENA_PN: TP#; MAXPartNumber: TP#; ComponentLink1Description: Manufacturer URL; ComponentLink2Description: Datasheet; ComponentLink3Description: Package Specification
U1 = ATmega2560-16AU: 8-bit AVR Microcontroller, 4.5-5.5V, 16MHz, 256KB Flash, 4KB EEPROM, 8KB SRAM, 86 GPIO pins, 100-pin TQFP, Industrial Grade (-40°C to 85°C), Pb-Free; DatasheetVersion: revN, May-2011; PackageVersion: revD, Oct-2010; PackageReference: 100A; PackageDescription: 100-Pin Thin Profile Plastic Quad Flat Pack (TQFP), 14 x 14 x 1.0 mm Body, 0.5 mm Pitch; Code_JEDEC: MS-026-AED; ComponentLink1Description: Manufacturer URL; ComponentLink1URL: http://www.atmel.com/; ComponentLink2Description: ATmega640/1280/1281/2560/2561 Datasheet; ComponentLink2URL: http://www.atmel.com/dyn/resources/prod_documents/doc2549.pdf; ComponentLink3Description: ATmega640/1280/1281/2560/2561 Summary; ComponentLink3URL: http://www.atmel.com/dyn/resources/prod_documents/2549S.pdf
U2 = TC105333ECTTR: PFM/PWM Step-Down DC/DC Controller, 1A, 3.3V, 300kHz, 5-Pin SOT-23, Industrial Temperature, Tape and Reel; Manufacturer: Microchip; DatasheetVersion: revB, Feb-2003; PackageVersion: revBB, Aug-2009; PackageReference: SOT-23-CT5; PackageDescription: 5-Lead Plastic Small Outline Transistor (CT) [SOT-23]; Supplier 1: Digi-Key; Supplier Part Number 1: TC105333ECTTR-ND; Supplier 2: Newark; Supplier Part Number 2: 92C5570; Supplier 3: Mouser; Supplier Part Number 3: 579-TC105333ECTTR; Mounting Technology: Surface Mount; Code_IPC: SOT23-5; PartNumber: TC105333ECTTR; ComponentLink1Description: Manufacturer URL; ComponentLink1URL: http://www.microchip.com/; ComponentLink2Description: Datasheet; ComponentLink2URL: http://ww1.microchip.com/downloads/en/DeviceDoc/21349b.pdf; ComponentLink3Description: Package Specification; ComponentLink3URL: http://www.microchip.com/stellent/groups/techpub_sg/documents/packagingspec/en012702.pdf
U9 = MicroSD Socket
U12 = SN75176: PartnumMAX: SP485E!

## Nets that join several sheets
GND: Fsociety_Keyboard_SCH_LED (75 pins), Fsociety_Keyboard_SCH_Main (49 pins)
VCC: Fsociety_Keyboard_SCH_LED (75 pins), Fsociety_Keyboard_SCH_Main (20 pins)
C1: Fsociety_Keyboard_SCH_Cherry (14 pins), Fsociety_Keyboard_SCH_Main (U1.97)
C2: Fsociety_Keyboard_SCH_Cherry (14 pins), Fsociety_Keyboard_SCH_Main (U1.96)
C3: Fsociety_Keyboard_SCH_Cherry (13 pins), Fsociety_Keyboard_SCH_Main (U1.95)
C4: Fsociety_Keyboard_SCH_Cherry (12 pins), Fsociety_Keyboard_SCH_Main (U1.94)
C5: Fsociety_Keyboard_SCH_Cherry (9 pins), Fsociety_Keyboard_SCH_Main (U1.93)
R1: Fsociety_Keyboard_SCH_Cherry (5 pins), Fsociety_Keyboard_SCH_Main (U1.92)
R2: Fsociety_Keyboard_SCH_Cherry (5 pins), Fsociety_Keyboard_SCH_Main (U1.91)
R3: Fsociety_Keyboard_SCH_Cherry (5 pins), Fsociety_Keyboard_SCH_Main (U1.90)
R4: Fsociety_Keyboard_SCH_Cherry (5 pins), Fsociety_Keyboard_SCH_Main (U1.89)
R5: Fsociety_Keyboard_SCH_Cherry (5 pins), Fsociety_Keyboard_SCH_Main (U1.88)
R6: Fsociety_Keyboard_SCH_Cherry (5 pins), Fsociety_Keyboard_SCH_Main (U1.87)
R7: Fsociety_Keyboard_SCH_Cherry (5 pins), Fsociety_Keyboard_SCH_Main (U1.86)
R8: Fsociety_Keyboard_SCH_Cherry (5 pins), Fsociety_Keyboard_SCH_Main (U1.78)
R9: Fsociety_Keyboard_SCH_Cherry (5 pins), Fsociety_Keyboard_SCH_Main (U1.77)
R10: Fsociety_Keyboard_SCH_Cherry (*10.1 *24.1 *38.1 *51.1), Fsociety_Keyboard_SCH_Main (U1.76)
R11: Fsociety_Keyboard_SCH_Cherry (*11.1 *25.1 *39.1 *52.1), Fsociety_Keyboard_SCH_Main (U1.75)
R12: Fsociety_Keyboard_SCH_Cherry (*12.1 *26.1 *40.1 *53.1), Fsociety_Keyboard_SCH_Main (U1.74)
R13: Fsociety_Keyboard_SCH_Cherry (*13.1 *27.1 *41.1), Fsociety_Keyboard_SCH_Main (U1.73)
R14: Fsociety_Keyboard_SCH_Cherry (*14.1 *28.1), Fsociety_Keyboard_SCH_Main (U1.72)
RXW: Fsociety_Keyboard_SCH_LED (U11.31), Fsociety_Keyboard_SCH_Main (U1.45 U7.10)
TXW: Fsociety_Keyboard_SCH_LED (U11.30), Fsociety_Keyboard_SCH_Main (U1.46 U7.11)